# Altium schematic sheet Inertial Sensors.SchDoc
size A
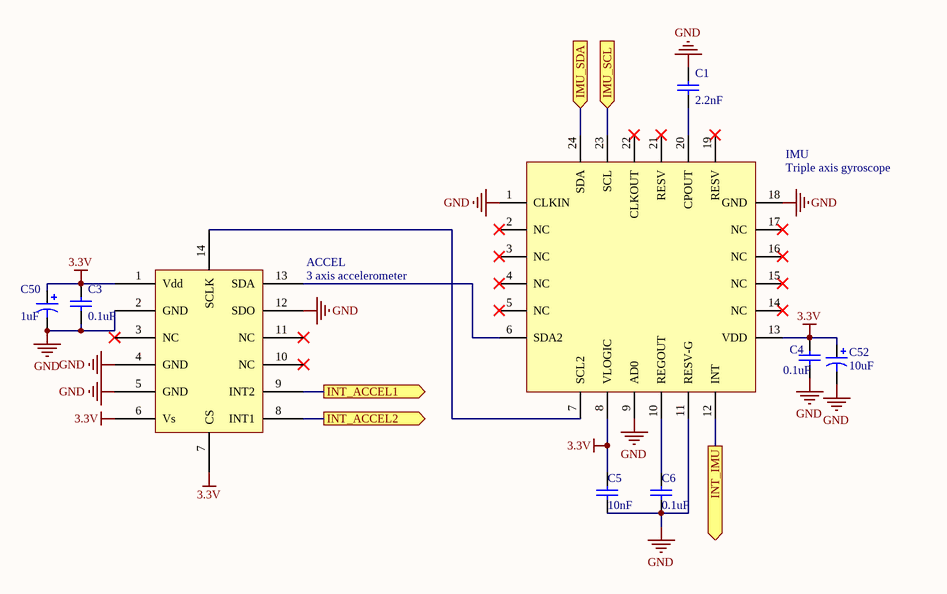
[diagram p0: Inertial Sensors.SchDoc]

## Parts
ACCEL  3 axis accelerometer  [16 pin 3mmx3mm LGA]
C1  value 2.2nF  [0603_CAP]  (hidden comment: X7R Cap)
C3  value 0.1uF  [0603_CAP]  (hidden comment: X7R Cap)
C4  value 0.1uF  [0603_CAP]  (hidden comment: X7R Cap)
C5  value 10nF  [0603_CAP]  (hidden comment: X7R Cap)
C6  value 0.1uF  [0603_CAP]  (hidden comment: X7R Cap)
C50  value 1uF  [0603_Cap]  (hidden comment: Cap Pol3)
C52  value 10uF  [0603_Cap]  (hidden comment: Cap Pol3)
IMU  Triple axis gyroscope  [QFN50P400X400X95-24N]

## Ports
IMU_SCL (in), IMU_SDA (in), INT_ACCEL1 (out), INT_ACCEL2 (out), INT_IMU (out)

## Nets
3.3V: ACCEL.1(Vdd) ACCEL.6(Vs) ACCEL.7(CS) C3.2 C4.2 C5.1 C50.1 C52.1 IMU.8(VLOGIC) IMU.13(VDD)
GND: ACCEL.2(GND) ACCEL.4(GND) ACCEL.5(GND) ACCEL.12(SDO) C1.1 C3.1 C4.1 C5.2 C6.1 C50.2 C52.2 IMU.1(CLKIN) IMU.9(AD0) IMU.11(RESV-G) IMU.18(GND)
IMU_SCL: IMU.23(SCL) ; port IMU_SCL
IMU_SDA: IMU.24(SDA) ; port IMU_SDA
INT_ACCEL1: ACCEL.9(INT2) ; port INT_ACCEL1
INT_ACCEL2: ACCEL.8(INT1) ; port INT_ACCEL2
INT_IMU: IMU.12(INT) ; port INT_IMU
NetACCEL_13: ACCEL.13(SDA) IMU.6(SDA2)
NetACCEL_14: ACCEL.14(SCLK) IMU.7(SCL2)
NetC1_2: C1.2 IMU.20(CPOUT)
NetC6_2: C6.2 IMU.10(REGOUT)

Not connected (* = marked no-connect by the designer): ACCEL 3(NC)* 10(NC)* 11(NC)*; IMU 2(NC)* 3(NC)* 4(NC)* 5(NC)* 14(NC)* 15(NC)* 16(NC)* 17(NC)* 19(RESV)* 21(RESV)* 22(CLKOUT)*

## Library data of the parts
ACCEL = ADXL345: ADXL345BCCZ-RLCT-ND; Manufacturer: Analog Devices Inc; Description: IC ACCEL SPI/I2C 3AX 3G 14LGA; Axis: X, Y, Z; Acceleration Range: ±2g, 4g, 8g, 16g; Sensitivity: 256LSB/g, 128LSB/g, 64LSB/g, 32LSB/g; Voltage - Supply: 2 V ~ 3.6 V; Output Type: Digital; Bandwidth: 6.25Hz ~ 3.2kHz Selectable; Interface: I²C, SPI; Supplier 1: Digi-Key; Supplier Part Number 1: ADXL345BCCZ-RLCT-ND; Manufacturer Part Number: ADXL345BCCZ-RL; RoHS: RoHS Compliant; Category: Sensors, Transducers; Stock 1: 13838; Pricing 1: 1=7.79, 25=6.4712, 100=5.8828, 250=5.29452, 500=4.85332, 1000=4.26503, 2500=4.04444 (USD); Mounting Type: Surface Mount; Package / Case: 14-VFLGA; Supplier Device Package: 14-LGA (3x5); ComponentLink1URL: http://www.analog.com/static/imported-files/data_sheets/ADXL345.pdf; ComponentLink1Description: http://www.analog.com/static/imported-files/data_sheets/ADXL345.pdf
C1 C3-C6 = Cap: Capacitor; Published: 8-Jun-2000; LatestRevisionDate: 17-Jul-2002; LatestRevisionNote: Re-released for DXP Platform.; PackageReference: RAD-0.3; Publisher: Altium Limited
C50 C52 = Cap Pol3: Polarized Capacitor (Surface Mount); Published: 8-Jun-2000; LatestRevisionDate: 29-May-2009; LatestRevisionNote: IPC-7351 Footprint Added.; PackageReference: C0805; Publisher: Altium Limited; PackageDescription: Chip Capacitor
IMU = IMU-3000: Supplier 1: Invensense